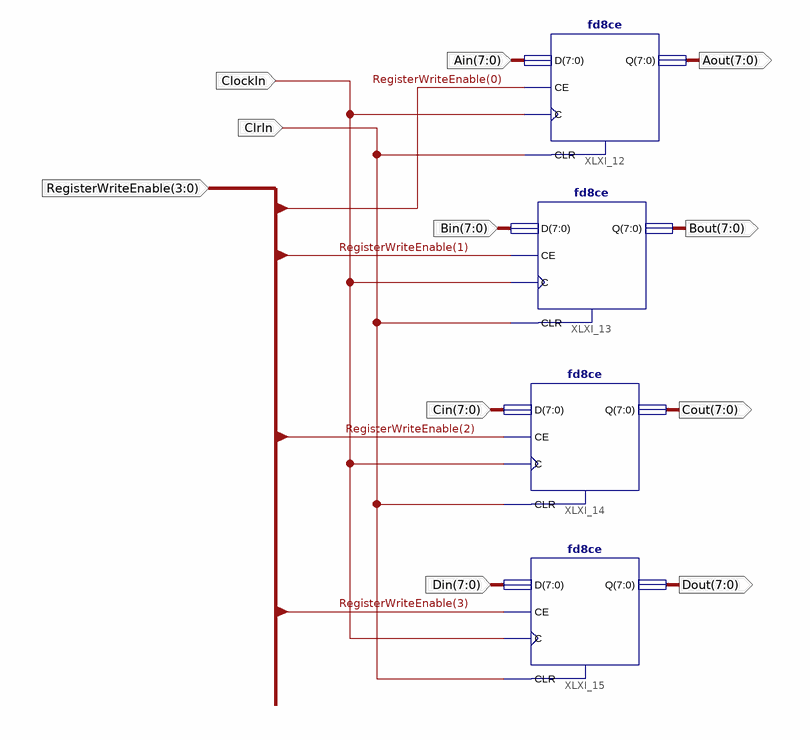
[diagram p0: schematic sheet 1]
// Xilinx ISE schematic ABCRegisters.sch (spartan3e) as structural Verilog: 4 symbols, 11 ports
module ABCRegisters (
  input  [7:0] Cin,
  input  [7:0] Bin,
  input  [7:0] Ain,
  input  ClockIn,
  input  ClrIn,
  input  [3:0] RegisterWriteEnable,
  input  [7:0] Din,
  output [7:0] Aout,
  output [7:0] Bout,
  output [7:0] Cout,
  output [7:0] Dout
);

  fd8ce XLXI_12 (.C(ClockIn), .CE(RegisterWriteEnable[0]), .CLR(ClrIn), .D(Ain), .Q(Aout));
  fd8ce XLXI_13 (.C(ClockIn), .CE(RegisterWriteEnable[1]), .CLR(ClrIn), .D(Bin), .Q(Bout));
  fd8ce XLXI_14 (.C(ClockIn), .CE(RegisterWriteEnable[2]), .CLR(ClrIn), .D(Cin), .Q(Cout));
  fd8ce XLXI_15 (.C(ClockIn), .CE(RegisterWriteEnable[3]), .CLR(ClrIn), .D(Din), .Q(Dout));
endmodule
